# EAGLE schematic Motherboard Schematics - 1 - 29_Dec_2020 (EAGLE 9.6.2)
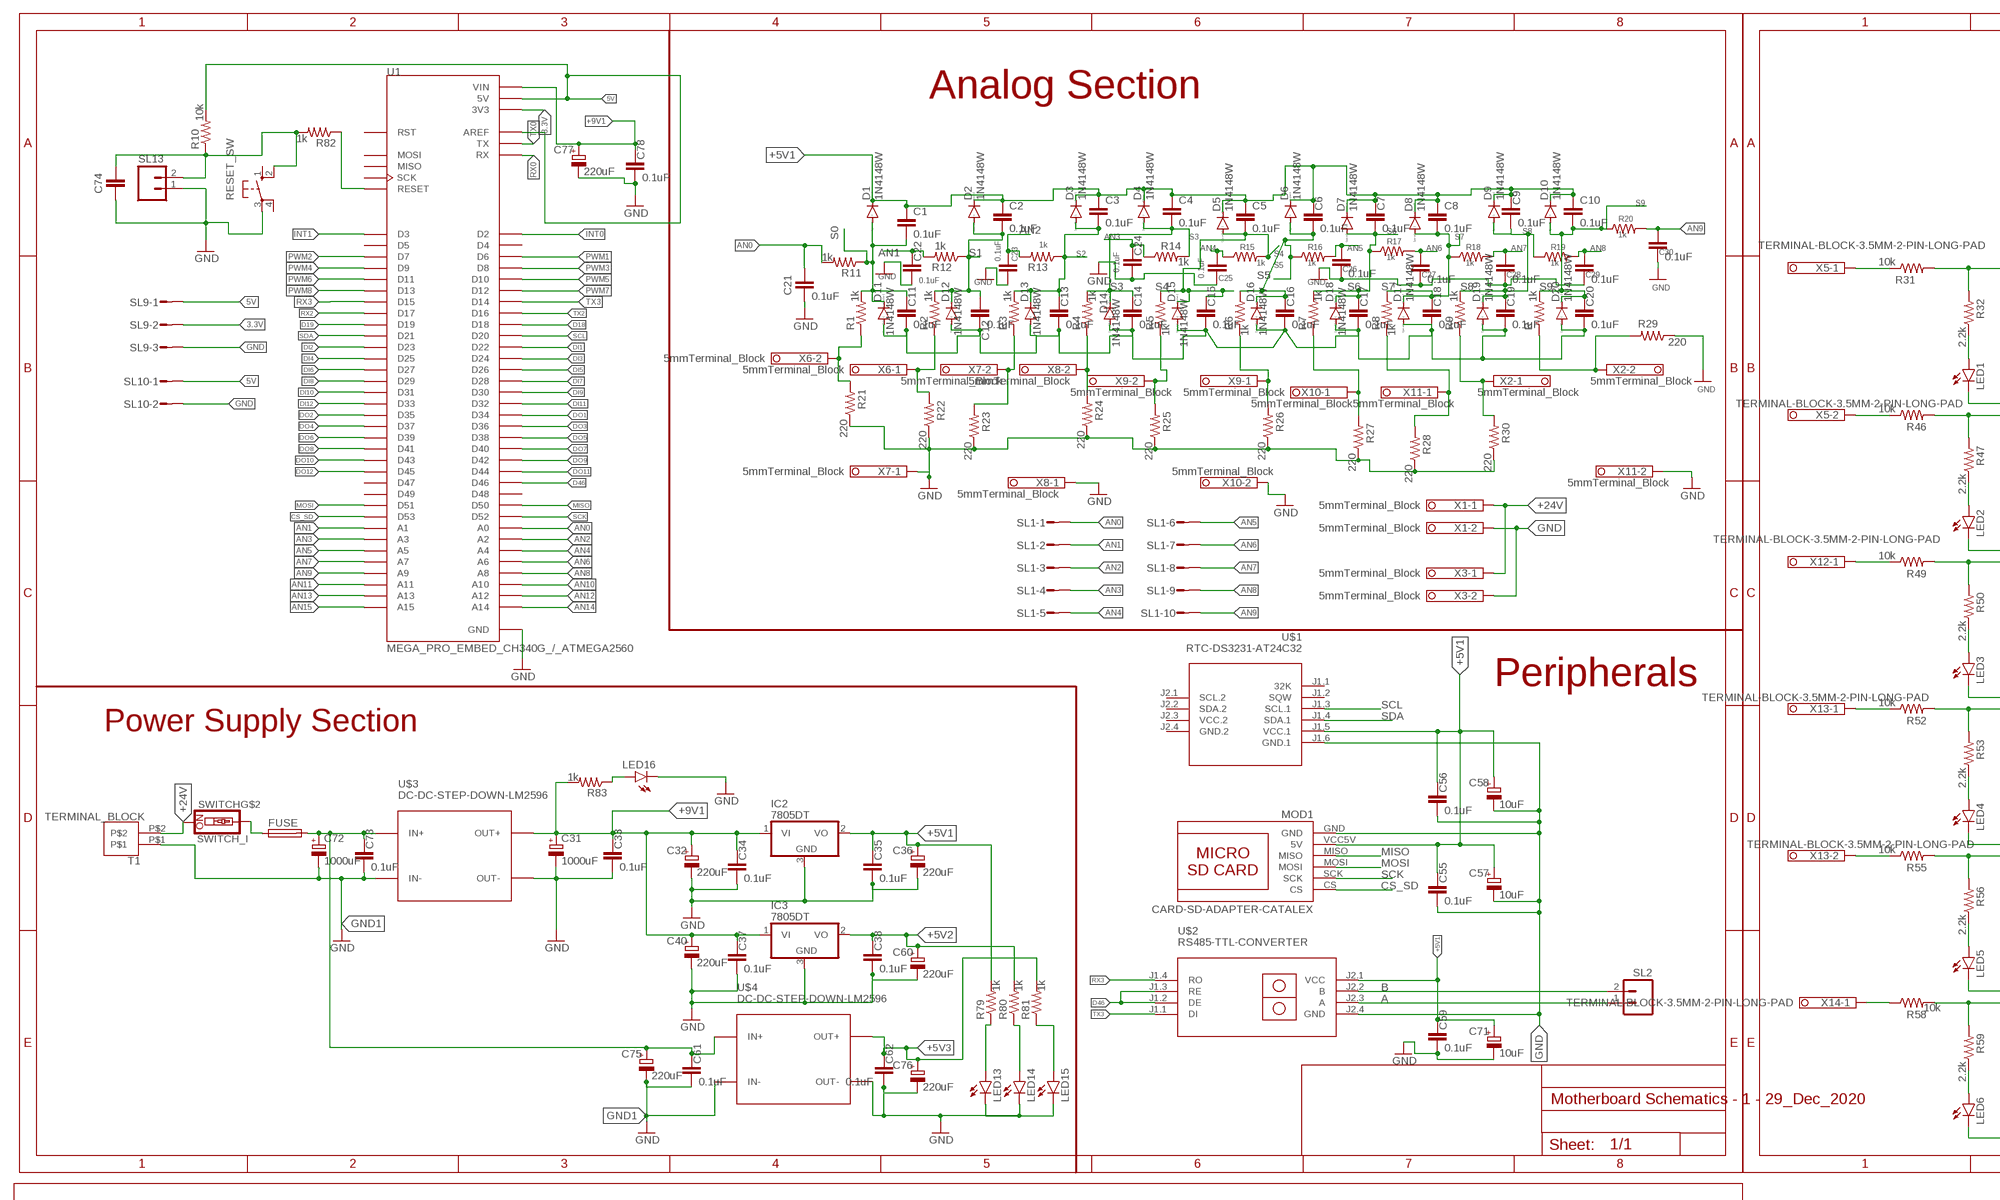
[diagram p0: schematic, sheet 1, part 1 of 3]
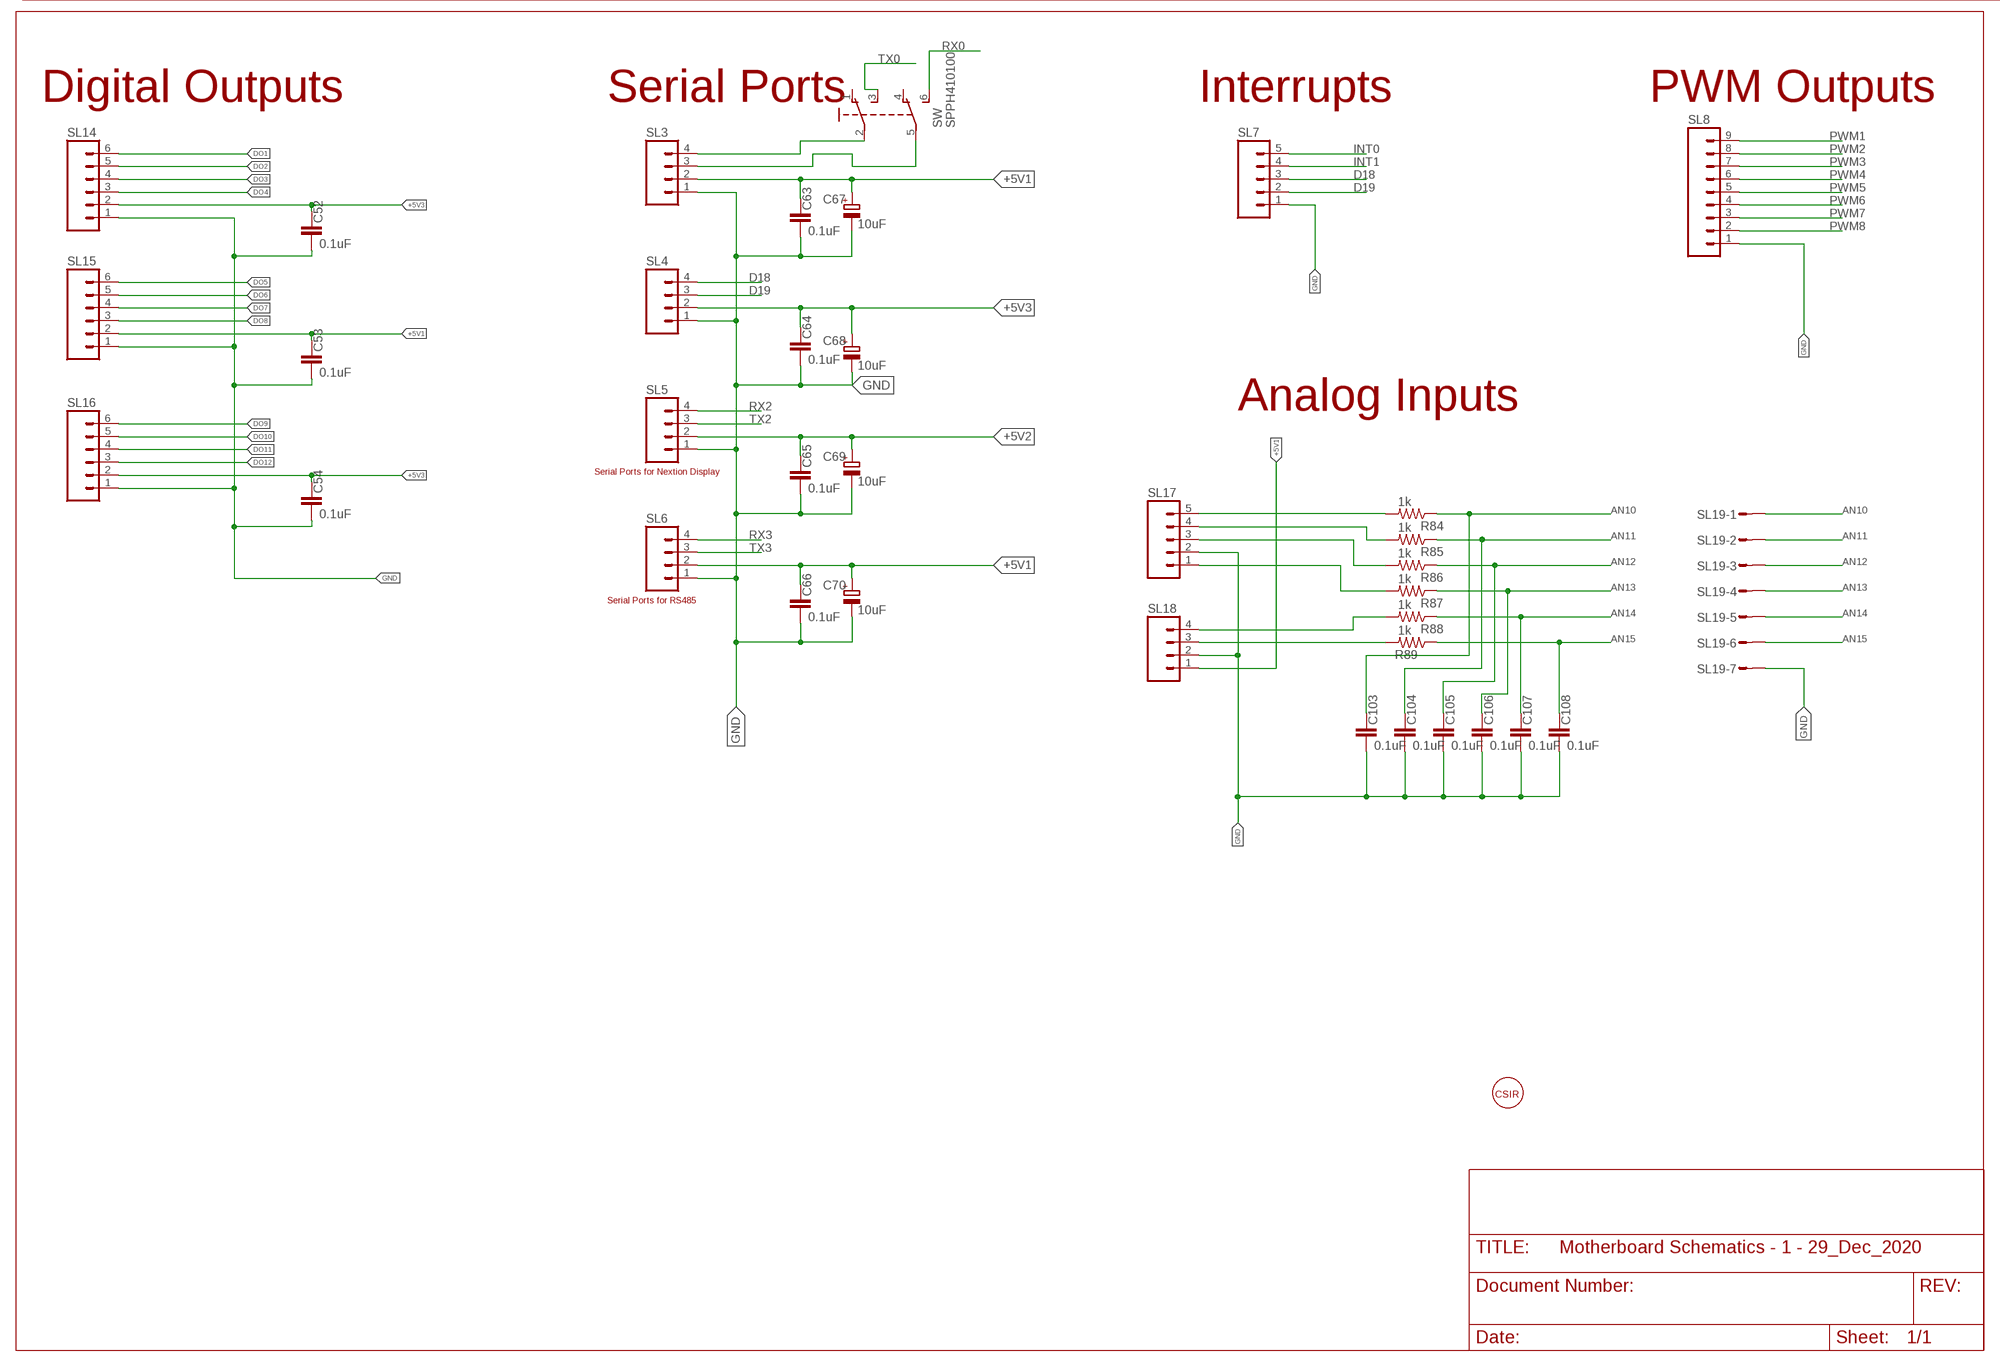
[diagram p1: schematic, sheet 1, part 2 of 3]
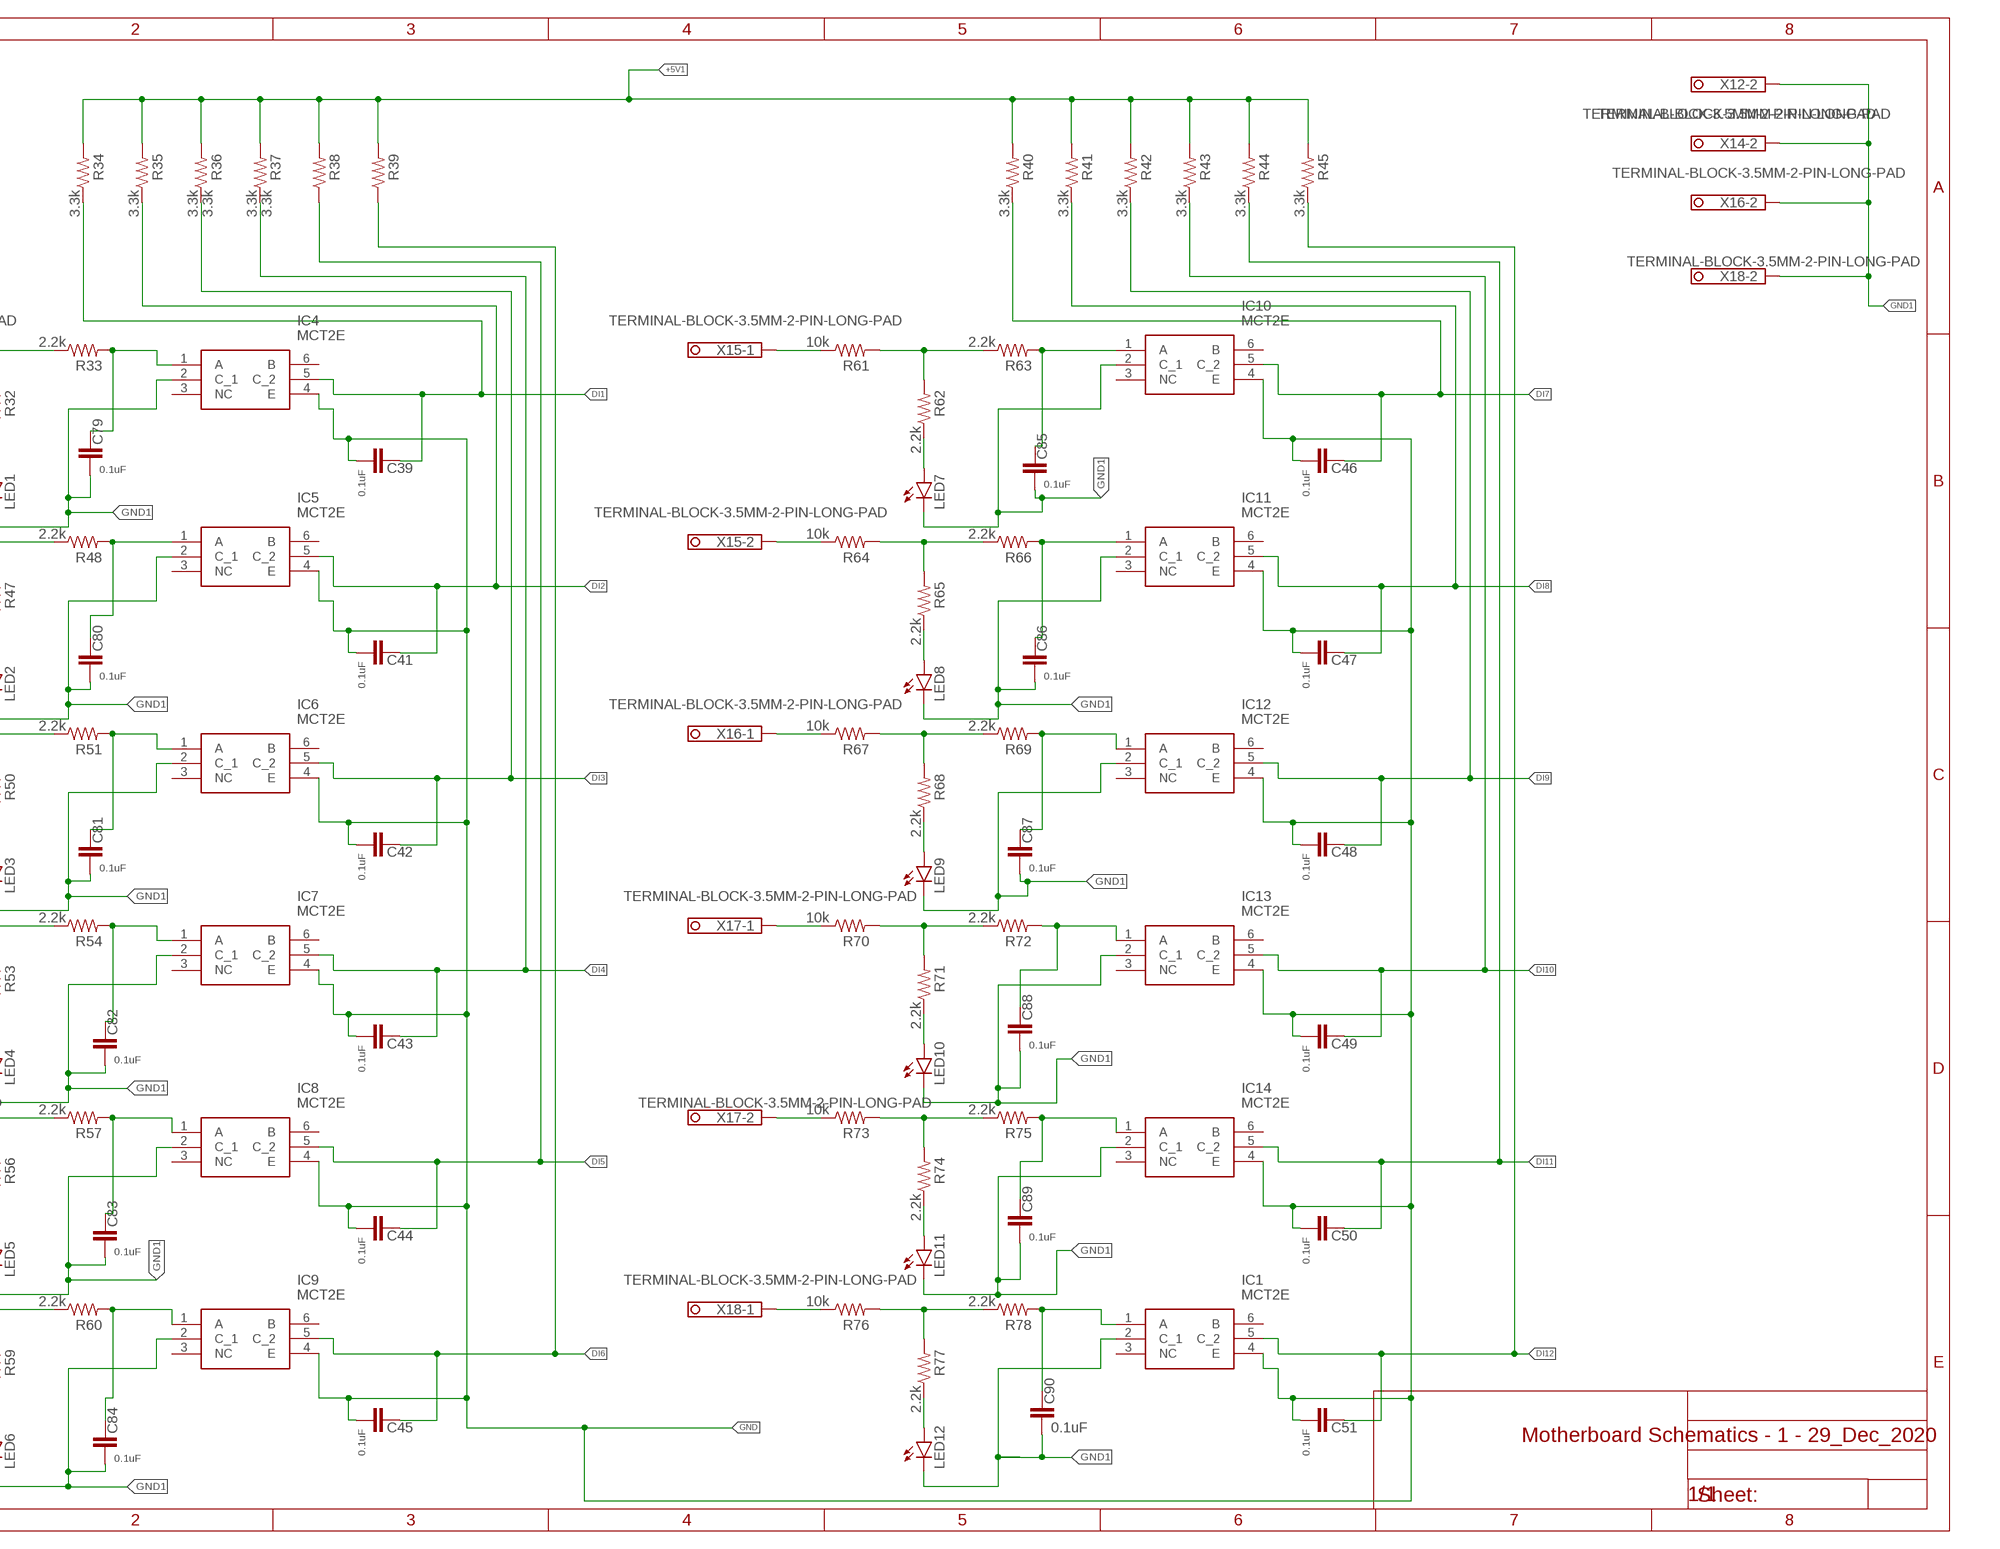
[diagram p2: schematic, sheet 1, part 3 of 3]

## Parts
C1  0.1uF  C-EUC1206  [C1206]
C2  0.1uF  C-EUC1206  [C1206]
C3  0.1uF  C-EUC1206  [C1206]
C4  0.1uF  C-EUC1206  [C1206]
C5  0.1uF  C-EUC1206  [C1206]
C6  0.1uF  C-EUC1206  [C1206]
C7  0.1uF  C-EUC1206  [C1206]
C8  0.1uF  C-EUC1206  [C1206]
C9  0.1uF  C-EUC1206  [C1206]
C10  0.1uF  C-EUC1206  [C1206]
C11  0.1uF  C-EUC1206  [C1206]
C12  0.1uF  C-EUC1206  [C1206]
C13  0.1uF  C-EUC1206  [C1206]
C14  0.1uF  C-EUC1206  [C1206]
C15  0.1uF  C-EUC1206  [C1206]
C16  0.1uF  C-EUC1206  [C1206]
C17  0.1uF  C-EUC1206  [C1206]
C18  0.1uF  C-EUC1206  [C1206]
C19  0.1uF  C-EUC1206  [C1206]
C20  0.1uF  C-EUC1206  [C1206]
C21  0.1uF  C-EUC1206  [C1206]
C22  0.1uF  C-EUC1206  [C1206]
C23  0.1uF  C-EUC1206  [C1206]
C24  0.1uF  C-EUC1206  [C1206]
C25  0.1uF  C-EUC1206  [C1206]
C26  0.1uF  C-EUC1206  [C1206]
C27  0.1uF  C-EUC1206  [C1206]
C28  0.1uF  C-EUC1206  [C1206]
C29  0.1uF  C-EUC1206  [C1206]
C30  0.1uF  C-EUC1206  [C1206]
C31  1000uF  CPOL-EUE7.5-16  [E7,5-16]
C32  220uF  CPOL-EUE5-10.5  [E5-10,5]
C33  0.1uF  C-EUC1206  [C1206]
C34  0.1uF  C-EUC1206  [C1206]
C35  0.1uF  C-EUC1206  [C1206]
C36  220uF  CPOL-EUE5-10.5  [E5-10,5]
C37  0.1uF  C-EUC1206  [C1206]
C38  0.1uF  C-EUC1206  [C1206]
C39  0.1uF  C-EUC1206  [C1206]
C40  220uF  CPOL-EUE5-10.5  [E5-10,5]
C41  0.1uF  C-EUC1206  [C1206]
C42  0.1uF  C-EUC1206  [C1206]
C43  0.1uF  C-EUC1206  [C1206]
C44  0.1uF  C-EUC1206  [C1206]
C45  0.1uF  C-EUC1206  [C1206]
C46  0.1uF  C-EUC1206  [C1206]
C47  0.1uF  C-EUC1206  [C1206]
C48  0.1uF  C-EUC1206  [C1206]
C49  0.1uF  C-EUC1206  [C1206]
C50  0.1uF  C-EUC1206  [C1206]
C51  0.1uF  C-EUC1206  [C1206]
C52  0.1uF  C-EUC1206  [C1206]
C53  0.1uF  C-EUC1206  [C1206]
C54  0.1uF  C-EUC1206  [C1206]
C55  0.1uF  C-EUC1206  [C1206]
C56  0.1uF  C-EUC1206  [C1206]
C57  10uF  CPOL-EUE2.5-7  [E2,5-7]
C58  10uF  CPOL-EUE2.5-7  [E2,5-7]
C59  0.1uF  C-EUC1206  [C1206]
C60  220uF  CPOL-EUE5-10.5  [E5-10,5]
C61  0.1uF  C-EUC1206  [C1206]
C62  0.1uF  C-EUC1206  [C1206]
C63  0.1uF  C-EUC1206  [C1206]
C64  0.1uF  C-EUC1206  [C1206]
C65  0.1uF  C-EUC1206  [C1206]
C66  0.1uF  C-EUC1206  [C1206]
C67  10uF  CPOL-EUE2.5-7  [E2,5-7]
C68  10uF  CPOL-EUE2.5-7  [E2,5-7]
C69  10uF  CPOL-EUE2.5-7  [E2,5-7]
C70  10uF  CPOL-EUE2.5-7  [E2,5-7]
C71  10uF  CPOL-EUE2.5-7  [E2,5-7]
C72  1000uF  CPOL-EUE7.5-16  [E7,5-16]
C73  0.1uF  C-EUC1206  [C1206]
C74  0.1uF  C-EUC1206  [C1206]
C75  220uF  CPOL-EUE5-10.5  [E5-10,5]
C76  220uF  CPOL-EUE5-10.5  [E5-10,5]
C77  220uF  CPOL-EUE5-10.5  [E5-10,5]
C78  0.1uF  C-EUC1206  [C1206]
C79  0.1uF  C-EUC1206  [C1206]
C80  0.1uF  C-EUC1206  [C1206]
C81  0.1uF  C-EUC1206  [C1206]
C82  0.1uF  C-EUC1206  [C1206]
C83  0.1uF  C-EUC1206  [C1206]
C84  0.1uF  C-EUC1206  [C1206]
C85  0.1uF  C-EUC1206  [C1206]
C86  0.1uF  C-EUC1206  [C1206]
C87  0.1uF  C-EUC1206  [C1206]
C88  0.1uF  C-EUC1206  [C1206]
C89  0.1uF  C-EUC1206  [C1206]
C90  0.1uF  C-EUC1206  [C1206]
C103  0.1uF  C-EUC1206  [C1206]
C104  0.1uF  C-EUC1206  [C1206]
C105  0.1uF  C-EUC1206  [C1206]
C106  0.1uF  C-EUC1206  [C1206]
C107  0.1uF  C-EUC1206  [C1206]
C108  0.1uF  C-EUC1206  [C1206]
D1  1N4148W  DIODE-DO214AC  [DO214AC]
D2  1N4148W  DIODE-DO214AC  [DO214AC]
D3  1N4148W  DIODE-DO214AC  [DO214AC]
D4  1N4148W  DIODE-DO214AC  [DO214AC]
D5  1N4148W  DIODE-DO214AC  [DO214AC]
D6  1N4148W  DIODE-DO214AC  [DO214AC]
D7  1N4148W  DIODE-DO214AC  [DO214AC]
D8  1N4148W  DIODE-DO214AC  [DO214AC]
D9  1N4148W  DIODE-DO214AC  [DO214AC]
D10  1N4148W  DIODE-DO214AC  [DO214AC]
D11  1N4148W  DIODE-DO214AC  [DO214AC]
D12  1N4148W  DIODE-DO214AC  [DO214AC]
D13  1N4148W  DIODE-DO214AC  [DO214AC]
D14.  1N4148W  DIODE-DO214AC  [DO214AC]
D15  1N4148W  DIODE-DO214AC  [DO214AC]
D16  1N4148W  DIODE-DO214AC  [DO214AC]
D17  1N4148W  DIODE-DO214AC  [DO214AC]
D18  1N4148W  DIODE-DO214AC  [DO214AC]
D19  1N4148W  DIODE-DO214AC  [DO214AC]
D20  1N4148W  DIODE-DO214AC  [DO214AC]
FUSE  SH22,5A  [SH22,5A]
IC1  MCT2E  [DIP762W60P254L712H480Q6N]
IC2  7805DT  [TO252]
IC3  7805DT  [TO252]
IC4  MCT2E  [DIP762W60P254L712H480Q6N]
IC5  MCT2E  [DIP762W60P254L712H480Q6N]
IC6  MCT2E  [DIP762W60P254L712H480Q6N]
IC7  MCT2E  [DIP762W60P254L712H480Q6N]
IC8  MCT2E  [DIP762W60P254L712H480Q6N]
IC9  MCT2E  [DIP762W60P254L712H480Q6N]
IC10  MCT2E  [DIP762W60P254L712H480Q6N]
IC11  MCT2E  [DIP762W60P254L712H480Q6N]
IC12  MCT2E  [DIP762W60P254L712H480Q6N]
IC13  MCT2E  [DIP762W60P254L712H480Q6N]
IC14  MCT2E  [DIP762W60P254L712H480Q6N]
LED1  LEDCHIPLED_1206  [CHIPLED_1206]
LED2  LEDCHIPLED_1206  [CHIPLED_1206]
LED3  LEDCHIPLED_1206  [CHIPLED_1206]
LED4  LEDCHIPLED_1206  [CHIPLED_1206]
LED5  LEDCHIPLED_1206  [CHIPLED_1206]
LED6  LEDCHIPLED_1206  [CHIPLED_1206]
LED7  LEDCHIPLED_1206  [CHIPLED_1206]
LED8  LEDCHIPLED_1206  [CHIPLED_1206]
LED9  LEDCHIPLED_1206  [CHIPLED_1206]
LED10  LEDCHIPLED_1206  [CHIPLED_1206]
LED11  LEDCHIPLED_1206  [CHIPLED_1206]
LED12  LEDCHIPLED_1206  [CHIPLED_1206]
LED13  LEDCHIPLED_1206  [CHIPLED_1206]
LED14  LEDCHIPLED_1206  [CHIPLED_1206]
LED15  LEDCHIPLED_1206  [CHIPLED_1206]
LED16  LEDCHIPLED_1206  [CHIPLED_1206]
MOD1  CARD-SD-ADAPTER-CATALEX  [CARD-SD-ADAPTER-CATALEX]
R  1k  R-US_R1206  [R1206]
R1  1k  R-US_R1206  [R1206]
R2  1k  R-US_R1206  [R1206]
R3  1k  R-US_R1206  [R1206]
R4  1k  R-US_R1206  [R1206]
R5  1k  R-US_R1206  [R1206]
R6  1k  R-US_R1206  [R1206]
R7  1k  R-US_R1206  [R1206]
R8  1k  R-US_R1206  [R1206]
R9  1k  R-US_R1206  [R1206]
R10  10k  R-US_R1206  [R1206]
R11  1k  R-US_R1206  [R1206]
R12  1k  R-US_R1206  [R1206]
R13  1k  R-US_R1206  [R1206]
R14  1k  R-US_R1206  [R1206]
R15  1k  R-US_R1206  [R1206]
R16  1k  R-US_R1206  [R1206]
R17  1k  R-US_R1206  [R1206]
R18  1k  R-US_R1206  [R1206]
R19  1k  R-US_R1206  [R1206]
R20  1k  R-US_R1206  [R1206]
R21  220  R-US_R1206  [R1206]
R22  220  R-US_R1206  [R1206]
R23  220  R-US_R1206  [R1206]
R24  220  R-US_R1206  [R1206]
R25  220  R-US_R1206  [R1206]
R26  220  R-US_R1206  [R1206]
R27  220  R-US_R1206  [R1206]
R28  220  R-US_R1206  [R1206]
R29  220  R-US_R1206  [R1206]
R30  220  R-US_R1206  [R1206]
R31  10k  R-US_R1206  [R1206]
R32  2.2k  R-US_R1206  [R1206]
R33  2.2k  R-US_R1206  [R1206]
R34  3.3k  R-US_R1206  [R1206]
R35  3.3k  R-US_R1206  [R1206]
R36  3.3k  R-US_R1206  [R1206]
R37  3.3k  R-US_R1206  [R1206]
R38  3.3k  R-US_R1206  [R1206]
R39  3.3k  R-US_R1206  [R1206]
R40  3.3k  R-US_R1206  [R1206]
R41  3.3k  R-US_R1206  [R1206]
R42  3.3k  R-US_R1206  [R1206]
R43  3.3k  R-US_R1206  [R1206]
R44  3.3k  R-US_R1206  [R1206]
R45  3.3k  R-US_R1206  [R1206]
R46  10k  R-US_R1206  [R1206]
R47  2.2k  R-US_R1206  [R1206]
R48  2.2k  R-US_R1206  [R1206]
R49  10k  R-US_R1206  [R1206]
R50  2.2k  R-US_R1206  [R1206]
R51  2.2k  R-US_R1206  [R1206]
R52  10k  R-US_R1206  [R1206]
R53  2.2k  R-US_R1206  [R1206]
R54  2.2k  R-US_R1206  [R1206]
R55  10k  R-US_R1206  [R1206]
R56  2.2k  R-US_R1206  [R1206]
R57  2.2k  R-US_R1206  [R1206]
R58  10k  R-US_R1206  [R1206]
R59  2.2k  R-US_R1206  [R1206]
R60  2.2k  R-US_R1206  [R1206]
R61  10k  R-US_R1206  [R1206]
R62  2.2k  R-US_R1206  [R1206]
R63  2.2k  R-US_R1206  [R1206]
R64  10k  R-US_R1206  [R1206]
R65  2.2k  R-US_R1206  [R1206]
R66  2.2k  R-US_R1206  [R1206]
R67  10k  R-US_R1206  [R1206]
R68  2.2k  R-US_R1206  [R1206]
R69  2.2k  R-US_R1206  [R1206]
R70  10k  R-US_R1206  [R1206]
R71  2.2k  R-US_R1206  [R1206]
R72  2.2k  R-US_R1206  [R1206]
R73  10k  R-US_R1206  [R1206]
R74  2.2k  R-US_R1206  [R1206]
R75  2.2k  R-US_R1206  [R1206]
R76  10k  R-US_R1206  [R1206]
R77  2.2k  R-US_R1206  [R1206]
R78  2.2k  R-US_R1206  [R1206]
R79  1k  R-US_R1206  [R1206]
R80  1k  R-US_R1206  [R1206]
R81  1k  R-US_R1206  [R1206]
R82  1k  R-US_R1206  [R1206]
R83  1k  R-US_R1206  [R1206]
R84  1k  R-US_R1206  [R1206]
R85  1k  R-US_R1206  [R1206]
R86  1k  R-US_R1206  [R1206]
R87  1k  R-US_R1206  [R1206]
R88  1k  R-US_R1206  [R1206]
R89  1k  R-US_R1206  [R1206]
RESET_SW  10-XX  [B3F-10XX]
SL1  M10S  [10P]
SL2  M02  [02P]
SL3  M04  [04P]
SL4  M04  [04P]
SL5  M04  [04P]
SL6  M04  [04P]
SL7  M05  [05P]
SL8  M09  [09P]
SL9  M03S  [03P]
SL10  M02S  [02P]
SL13  M02  [02P]
SL14  M06  [06P]
SL15  M06  [06P]
SL16  M06  [06P]
SL17  M05  [05P]
SL18  M04  [04P]
SL19  M07S  [07P]
SW  SPPH410100  [SPPH410100]
SWITCH  SWITCH_I  [SWITCH_I]
T1  TERMINAL_BLOCK  [BOC_TERMINAL]
U1  MEGA_PRO_EMBED_CH340G_/_ATMEGA2560  [MODULE_MEGA_PRO_EMBED_CH340G_/_ATMEGA2560]
U$1  RTC-DS3231-AT24C32  [RTC-DS3231-AT24C32]
U$2  RS485-TTL-CONVERTER  [RS485-TTL-CONVERTER]
U$3  DC-DC-STEP-DOWN-LM2596  [DC-DC-STEP-DOWN-LM2596]
U$4  DC-DC-STEP-DOWN-LM2596  [DC-DC-STEP-DOWN-LM2596]
U$5  CSIR_LOGO  [CSIR_LOGO]
X1  5mmTerminal_Block  TERMINAL-BLOCK-3.5MM-2-PIN-LONG-PAD  [TERMINAL-BLOCK-2-PIN-3.5MM-LONG-PAD]
X2  5mmTerminal_Block  TERMINAL-BLOCK-3.5MM-2-PIN-LONG-PAD  [TERMINAL-BLOCK-2-PIN-3.5MM-LONG-PAD]
X3  5mmTerminal_Block  TERMINAL-BLOCK-3.5MM-2-PIN-LONG-PAD  [TERMINAL-BLOCK-2-PIN-3.5MM-LONG-PAD]
X5  TERMINAL-BLOCK-3.5MM-2-PIN-LONG-PAD  [TERMINAL-BLOCK-2-PIN-3.5MM-LONG-PAD]
X6  5mmTerminal_Block  TERMINAL-BLOCK-3.5MM-2-PIN-LONG-PAD  [TERMINAL-BLOCK-2-PIN-3.5MM-LONG-PAD]
X7  5mmTerminal_Block  TERMINAL-BLOCK-3.5MM-2-PIN-LONG-PAD  [TERMINAL-BLOCK-2-PIN-3.5MM-LONG-PAD]
X8  5mmTerminal_Block  TERMINAL-BLOCK-3.5MM-2-PIN-LONG-PAD  [TERMINAL-BLOCK-2-PIN-3.5MM-LONG-PAD]
X9  5mmTerminal_Block  TERMINAL-BLOCK-3.5MM-2-PIN-LONG-PAD  [TERMINAL-BLOCK-2-PIN-3.5MM-LONG-PAD]
X10  5mmTerminal_Block  TERMINAL-BLOCK-3.5MM-2-PIN-LONG-PAD  [TERMINAL-BLOCK-2-PIN-3.5MM-LONG-PAD]
X11  5mmTerminal_Block  TERMINAL-BLOCK-3.5MM-2-PIN-LONG-PAD  [TERMINAL-BLOCK-2-PIN-3.5MM-LONG-PAD]
X12  TERMINAL-BLOCK-3.5MM-2-PIN-LONG-PAD  [TERMINAL-BLOCK-2-PIN-3.5MM-LONG-PAD]
X13  TERMINAL-BLOCK-3.5MM-2-PIN-LONG-PAD  [TERMINAL-BLOCK-2-PIN-3.5MM-LONG-PAD]
X14  TERMINAL-BLOCK-3.5MM-2-PIN-LONG-PAD  [TERMINAL-BLOCK-2-PIN-3.5MM-LONG-PAD]
X15  TERMINAL-BLOCK-3.5MM-2-PIN-LONG-PAD  [TERMINAL-BLOCK-2-PIN-3.5MM-LONG-PAD]
X16  TERMINAL-BLOCK-3.5MM-2-PIN-LONG-PAD  [TERMINAL-BLOCK-2-PIN-3.5MM-LONG-PAD]
X17  TERMINAL-BLOCK-3.5MM-2-PIN-LONG-PAD  [TERMINAL-BLOCK-2-PIN-3.5MM-LONG-PAD]
X18  TERMINAL-BLOCK-3.5MM-2-PIN-LONG-PAD  [TERMINAL-BLOCK-2-PIN-3.5MM-LONG-PAD]

## Nets
3.3V: SL9.2 U1.3V3_1(3V3) U1.3V3_2(3V3)
5V: R10.2 SL9.1 SL10.1 U1.5V_1(5V) U1.5V_2(5V) U1.5V_3(5V) U1.AREF
+5V1: C1.1 C2.1 C3.1 C4.1 C5.1 C6.1 C7.1 C8.1 C9.1 C10.1 C35.1 C36.+ C53.1 C55.1 C56.1 C57.+ C58.+ C59.1 C63.1 C66.1 C67.+ C70.+ C71.+ D1.C D2.C D3.C D4.C D5.C D6.C D7.C D8.C D9.C D10.C IC2.2(VO) MOD1.VCC5V(5V) R34.2 R35.2 R36.2 R37.2 R38.2 R39.2 R40.2 R41.2 R42.2 R43.2 R44.2 R45.2 R79.2 SL3.2 SL6.2 SL15.2 SL18.1 U$1.J1.5(VCC.1) U$2.J2.1(VCC)
+5V2: C38.1 C60.+ C65.1 C69.+ IC3.2(VO) R80.2 SL5.2
+5V3: C52.1 C54.1 C62.1 C64.1 C68.+ C76.+ R81.2 SL4.2 SL14.2 SL16.2 U$4.OUT+
+9V1: C31.+ C32.+ C33.1 C34.1 C37.1 C40.+ C77.+ C78.1 IC2.1(VI) IC3.1(VI) R83.2 U1.VIN_1(VIN) U1.VIN_2(VIN) U$3.OUT+
+24V: SWITCH.P$3 T1.P$2 X1.1 X3.1
A: SL2.1 U$2.J2.3(A)
AN0: C21.1 R11.2 SL1.1 U1.A0
AN1: C22.1 R12.2 SL1.2 U1.A1
AN2: C23.1 R13.2 SL1.3 U1.A2
AN3: C24.1 R14.1 SL1.4 U1.A3
AN4: C25.1 R15.1 SL1.5 U1.A4
AN5: C26.1 R16.2 SL1.6 U1.A5
AN6: C27.1 R17.2 SL1.7 U1.A6
AN7: C28.1 R18.2 SL1.8 U1.A7
AN8: C29.1 R19.2 SL1.9 U1.A8
AN9: C30.1 R20.2 SL1.10 U1.A9
AN10: C103.1 R84.1 SL19.1 U1.A10
AN11: C104.1 R85.1 SL19.2 U1.A11
AN12: C105.1 R86.1 SL19.3 U1.A12
AN13: C106.1 R87.1 SL19.4 U1.A13
AN14: C107.1 R88.1 SL19.5 U1.A14
AN15: C108.1 R89.1 SL19.6 U1.A15
B: SL2.2 U$2.J2.2(B)
CS_SD: MOD1.CS U1.D53
D18: SL4.4 SL7.3 U1.D18
D19: SL4.3 SL7.2 U1.D19
D46: U1.D46 U$2.J1.2(DE) U$2.J1.3(RE)
DI1: C39.1 IC4.5(C_2) R34.1 U1.D22
DI2: C41.1 IC5.5(C_2) R35.1 U1.D23
DI3: C42.1 IC6.5(C_2) R36.1 U1.D24
DI4: C43.1 IC7.5(C_2) R37.1 U1.D25
DI5: C44.1 IC8.5(C_2) R38.1 U1.D26
DI6: C45.1 IC9.5(C_2) R39.1 U1.D27
DI7: C46.1 IC10.5(C_2) R40.1 U1.D28
DI8: C47.1 IC11.5(C_2) R41.1 U1.D29
DI9: C48.1 IC12.5(C_2) R42.1 U1.D30
DI10: C49.1 IC13.5(C_2) R43.1 U1.D31
DI11: C50.1 IC14.5(C_2) R44.1 U1.D32
DI12: C51.1 IC1.5(C_2) R45.1 U1.D33
DO1: SL14.6 U1.D34
DO2: SL14.5 U1.D35
DO3: SL14.4 U1.D36
DO4: SL14.3 U1.D37
DO5: SL15.6 U1.D38
DO6: SL15.5 U1.D39
DO7: SL15.4 U1.D40
DO8: SL15.3 U1.D41
DO9: SL16.6 U1.D42
DO10: SL16.5 U1.D43
DO11: SL16.4 U1.D44
DO12: SL16.3 U1.D45
GND: C21.2 C22.2 C23.2 C24.2 C25.2 C26.2 C27.2 C28.2 C29.2 C30.2 C31.- C32.- C33.2 C34.2 C35.2 C36.- C37.2 C38.2 C39.2 C40.- C41.2 C42.2 C43.2 C44.2 C45.2 C46.2 C47.2 C48.2 C49.2 C50.2 C51.2 C52.2 C53.2 C54.2 C55.2 C56.2 C57.- C58.- C59.2 C60.- C62.2 C63.2 C64.2 C65.2 C66.2 C67.- C68.- C69.- C70.- C71.- C74.2 C76.- C77.- C78.2 C103.2 C104.2 C105.2 C106.2 C107.2 C108.2 IC1.4(E) IC2.3(GND) IC3.3(GND) IC4.4(E) IC5.4(E) IC6.4(E) IC7.4(E) IC8.4(E) IC9.4(E) IC10.4(E) IC11.4(E) IC12.4(E) IC13.4(E) IC14.4(E) LED13.C LED14.C LED15.C LED16.C MOD1.GND R21.1 R22.1 R23.1 R24.1 R25.1 R26.1 R27.1 R28.1 R29.1 R30.1 RESET_SW.3(P) SL3.1 SL4.1 SL5.1 SL6.1 SL7.1 SL8.1 SL9.3 SL10.2 SL13.1 SL14.1 SL15.1 SL16.1 SL17.2 SL18.2 SL19.7 U1.GND_1(GND) U1.GND_2(GND) U1.GND_3(GND) U$1.J1.6(GND.1) U$2.J2.4(GND) U$3.OUT- U$4.OUT- X1.2 X3.2 X7.1 X8.1 X10.2 X11.2
GND1: C61.2 C72.- C73.2 C75.- C79.2 C80.2 C81.2 C82.2 C83.2 C84.2 C85.2 C86.2 C87.2 C88.2 C89.2 C90.2 IC1.2(C_1) IC4.2(C_1) IC5.2(C_1) IC6.2(C_1) IC7.2(C_1) IC8.2(C_1) IC9.2(C_1) IC10.2(C_1) IC11.2(C_1) IC12.2(C_1) IC13.2(C_1) IC14.2(C_1) LED1.C LED2.C LED3.C LED4.C LED5.C LED6.C LED7.C LED8.C LED9.C LED10.C LED11.C LED12.C T1.P$1 U$3.IN- U$4.IN- X12.2 X14.2 X16.2 X18.2 ; supply symbol labelled GND
INT0: SL7.5 U1.D2
INT1: SL7.4 U1.D3
MISO: MOD1.MISO U1.D50
MOSI: MOD1.MOSI U1.D51
N$1: C11.2 C12.2 C13.2 C14.2 C15.2 C16.2 C17.2 C18.2 C19.2 C20.2 D11.A D12.A D13.A D14..A D15.A D16.A D17.A D18.A D19.A D20.A
N$3: R2.1 R22.2 X6.1
N$4: R3.1 R23.2 X7.2
N$5: R4.1 R24.2 X8.2
N$6: R52.1 X13.1
N$7: R58.1 X14.1
N$8: R5.1 R25.2 X9.2
N$9: R6.1 R26.2 X9.1
N$10: R7.1 R27.2 X10.1
N$11: R8.1 R28.2 X11.1
N$12: R9.1 R30.2 X2.1
N$13: R1.1 R21.2 X6.2
N$14: FUSE.1 SWITCH.P$1
N$15: R82.1 U1.RESET
N$16: R29.2 R.1 X2.2
N$17: R31.1 X5.1
N$18: R31.2 R32.2 R33.1
N$19: C79.1 IC4.1(A) R33.2
N$20: LED1.A R32.1
N$21: R55.1 X13.2
N$22: R46.1 X5.2
N$23: C88.1 IC13.1(A) R72.2
N$24: R46.2 R47.2 R48.1
N$25: C80.1 IC5.1(A) R48.2
N$26: LED2.A R47.1
N$27: R73.1 X17.2
N$28: R70.1 X17.1
N$29: R49.1 X12.1
N$30: R49.2 R50.2 R51.1
N$31: C81.1 IC6.1(A) R51.2
N$32: LED3.A R50.1
N$33: R61.1 X15.1
N$34: R61.2 R62.2 R63.1
N$35: R64.1 X15.2
N$36: R52.2 R53.2 R54.1
N$37: C82.1 IC7.1(A) R54.2
N$38: LED4.A R53.1
N$40: C85.1 IC10.1(A) R63.2
N$41: R84.2 SL17.5
N$42: SL3.4 SW.2(P)
N$43: C61.1 C72.+ C73.1 C75.+ FUSE.2 U$3.IN+ U$4.IN+
N$44: C74.1 R10.1 R82.2 RESET_SW.2(S1) SL13.2
N$45: R55.2 R56.2 R57.1
N$46: C83.1 IC8.1(A) R57.2
N$47: LED5.A R56.1
N$49: LED7.A R62.1
N$51: R58.2 R59.2 R60.1
N$52: C84.1 IC9.1(A) R60.2
N$53: LED6.A R59.1
N$56: R85.2 SL17.4
N$59: R64.2 R65.2 R66.1
N$60: C86.1 IC11.1(A) R66.2
N$61: LED8.A R65.1
N$63: R67.1 X16.1
N$64: R67.2 R68.2 R69.1
N$65: C87.1 IC12.1(A) R69.2
N$66: LED9.A R68.1
N$68: R70.2 R71.2 R72.1
N$69: LED13.A R79.1
N$70: LED10.A R71.1
N$71: LED14.A R80.1
N$73: R73.2 R74.2 R75.1
N$74: C89.1 IC14.1(A) R75.2
N$75: LED11.A R74.1
N$77: R76.2 R77.2 R78.1
N$78: C90.1 IC1.1(A) R78.2
N$79: LED12.A R77.1
N$83: R76.1 X18.1
N$84: LED15.A R81.1
N$85: SL3.3 SW.5(P1)
N$86: R86.2 SL17.3
N$88: LED16.A R83.1
N$90: R87.2 SL17.1
N$92: R88.2 SL18.4
N$93: R89.2 SL18.3
PWM1: SL8.9 U1.D6
PWM2: SL8.8 U1.D7
PWM3: SL8.7 U1.D8
PWM4: SL8.6 U1.D9
PWM5: SL8.5 U1.D10
PWM6: SL8.4 U1.D11
PWM7: SL8.3 U1.D12
PWM8: SL8.2 U1.D13
RX0: SW.6(S1) U1.RX
RX2: SL5.4 U1.D17
RX3: SL6.4 U1.D15 U$2.J1.4(RO)
S0: C1.2 C11.1 D1.A D11.C R1.2 R11.1
S1: C2.2 C12.1 D2.A D12.C R2.2 R12.1
S2: C3.2 C13.1 D3.A D13.C R3.2 R13.1
S3: C4.2 C14.1 D4.A D14..C R4.2 R14.2
S4: C5.2 C15.1 D5.A D15.C R5.2 R15.2
S5: C6.2 C16.1 D6.A D16.C R6.2 R16.1
S6: C7.2 C17.1 D7.A D18.C R7.2 R17.1
S7: C8.2 C18.1 D8.A D17.C R8.2 R18.1
S8: C9.2 C19.1 D9.A D19.C R9.2 R19.1
S9: C10.2 C20.1 D10.A D20.C R20.1 R.2
SCK: MOD1.SCK U1.D52
SCL: U1.D20 U$1.J1.3(SCL.1)
SDA: U1.D21 U$1.J1.4(SDA.1)
TX0: SW.3(S) U1.TX
TX2: SL5.3 U1.D16
TX3: SL6.3 U1.D14 U$2.J1.1(DI)
Unconnected: IC1.3(NC) IC1.6(B) IC4.3(NC) IC4.6(B) IC5.3(NC) IC5.6(B) IC6.3(NC) IC6.6(B) IC7.3(NC) IC7.6(B) IC8.3(NC) IC8.6(B) IC9.3(NC) IC9.6(B) IC10.3(NC) IC10.6(B) IC11.3(NC) IC11.6(B) IC12.3(NC) IC12.6(B) IC13.3(NC) IC13.6(B) IC14.3(NC) IC14.6(B) RESET_SW.1(S) RESET_SW.4(P1) SW.1(O) SW.4(O1) U1.D4 U1.D5 U1.D47 U1.D48 U1.D49 U1.MISO U1.MOSI U1.RST U1.SCK U$1.J1.1(32K) U$1.J1.2(SQW) U$1.J2.1(SCL.2) U$1.J2.2(SDA.2)

## Notes on the sheet
- Analog Section
- Peripherals
- Power Supply Section
- Digital Outputs | Serial Ports | Interrupts | PWM Outputs
- Analog Inputs
- Serial Ports for Nextion Display
- Serial Ports for RS485

## Power pins joined to a net without a drawn wire
GND.2: U$1.J2.4(GND.2)
VCC.2: U$1.J2.3(VCC.2)

## Library data of the parts
C1-C30 C33-C35 C37-C39 C41-C56 C59 C61-C66 C73 C74 C78-C90 C103-C108 = rcl:C-EU: CAPACITOR, European symbol; SPICEPREFIX: C
C31 C32 C36 C40 C57 C58 C60 C67-C72 C75-C77 = rcl:CPOL-EU: POLARIZED CAPACITOR, European symbol; SPICEPREFIX: C
D1-D13 D14. D15-D20 = diode:DIODE-: DIODE
FUSE = fuse:SH22,5A: FUSE HOLDER grid 22,5mm, isolated cap OGN0031 8201, Schurter (Buerklin); MPN: 0031.7701.11; OC_FARNELL: unknown; OC_NEWARK: 04F1224
IC1 IC4-IC14 = MCT2E:MCT2E: Transistor Output Optocouplers Optocouplers Source: Datasheet <https://www.mouser.com/datasheet/2/143/201407061947416393-365513.pdf>; ARROW_PART_NUMBER: MCT2E; ARROW_PRICE-STOCK: https://www.arrow.com/en/products/mct2e/everlight-electronics; DESCRIPTION: Transistor Output Optocouplers Optocouplers; HEIGHT: 4.8mm; MANUFACTURER_NAME: Everlight; MANUFACTURER_PART_NUMBER: MCT2E; MOUSER_PART_NUMBER: 638-MCT2E; MOUSER_PRICE-STOCK: https://www.mouser.co.uk/ProductDetail/Everlight/MCT2E?qs=8PzhAHr7IdNay24oEWwF1g%3D%3D
IC2 IC3 = linear:78*: Positive VOLTAGE REGULATOR Source: http://cache.national.com/ds/LM/LM78L05.pdf http://www.fairchildsemi.com/ds/LM/LM7805.pdf
LED1-LED16 = led:LED: LED OSRAM: - CHIPLED LG R971, LG N971, LY N971, LG Q971, LY Q971, LO R971, LY R971 LH N974, LH R974 LS Q976, LO Q976, LY Q976 LO Q996 - Hyper CHIPLED LW Q18S LB Q993, LB Q99A, LB R99A - SideLED LS A670, LO A670, LY A670, LG A670, LP A670 LB A673, LV A673, LT A673, LW A673 LH A674 LY A675 LS A676, LA A676, LO A676, LY A676, LW A676 LS A679, LY A679, LG A679 - Hyper Micro SIDELED® LS Y876, LA Y876, LO Y876, LY Y876 LT Y87S - SmartLED LW L88C, LW L88S LB L89C, LB L89S, LG L890 LS L89K, LO L89K, LY L89K LS L896, LA L896, LO L896, LY L896 - TOPLED LS T670, LO T670, LY T670, LG T670, LP T670 LSG T670, LSP T670, LSY T670, LOP T670, LYG T670 LG T671, LOG T671, LSG T671 LB T673, LV T673, LT T673, LW T673 LH T674 LS T676, LA T676, LO T676, LY T676, LB T676, LH T676, LSB T676, LW T676 LB T67C, LV T67C, LT T67C, LS T67K, LO T67K, LY T67K, LW E67C LS E67B, LA E67B, LO E67B, LY E67B, LB E67C, LV E67C, LT E67C LW T67C LS T679, LY T679, LG T679 LS T770, LO T770, LY T770, LG T770, LP T770 LB T773, LV T773, LT T773, LW T773 LH T774 LS E675, LA E675, LY E675, LS T675 LS T776, LA T776, LO T776, LY T776, LB T776 LHGB T686 LT T68C, LB T68C - Hyper Mini TOPLED® LB M676 - Mini TOPLED Santana® LG M470 LS M47K, LO M47K, LY M47K Source: http://www.osram.convergy.de LUXEON: - LUMILED® LXK2-PW12-R00, LXK2-PW12-S00, LXK2-PW14-U00, LXK2-PW14-V00 LXK2-PM12-R00, LXK2-PM12-S00, LXK2-PM14-U00 LXK2-PE12-Q00, LXK2-PE12-R00, LXK2-PE12-S00, LXK2-PE14-T00, LXK2-PE14-U00 LXK2-PB12-K00, LXK2-PB12-L00, LXK2-PB12-M00, LXK2-PB14-N00, LXK2-PB14-P00, LXK2-PB14-Q00 LXK2-PR12-L00, LXK2-PR12-M00, LXK2-PR14-Q00, LXK2-PR14-R00 LXK2-PD12-Q00, LXK2-PD12-R00, LXK2-PD12-S00 LXK2-PH12-R00, LXK2-PH12-S00 LXK2-PL12-P00, LXK2-PL12-Q00, LXK2-PL12-R00 Source: www.luxeon.com KINGBRIGHT: KA-3528ASYC Source: www.kingbright.com
MOD1 = SD-Card-Module_CATALEX:CARD-SD-ADAPTER-CATALEX: Micro SD Card Adapter Module with onboard 3.3V regulator
R R2-R9 R11-R81 R83-R89 = rcl:R-US_: RESISTOR, American symbol; SPICEPREFIX: R
R1 R10 R82 = modified cap:R-US_: RESISTOR, American symbol; SPICEPREFIX: R
RESET_SW = switch-omron:10-XX: OMRON SWITCH; MPN: B3F-1000; OC_FARNELL: 176432; OC_NEWARK: 36M3542
SL1 = con-amp-quick:M10S: AMP QUICK CONNECTOR; OC_FARNELL: unknown; OC_NEWARK: unknown
SL2 SL13 = con-amp-quick:M02: AMP QUICK CONNECTOR; OC_FARNELL: unknown; OC_NEWARK: unknown
SL3-SL6 SL18 = con-amp-quick:M04: AMP QUICK CONNECTOR; OC_FARNELL: unknown; OC_NEWARK: unknown
SL7 SL17 = con-amp-quick:M05: AMP QUICK CONNECTOR; OC_FARNELL: unknown; OC_NEWARK: unknown
SL8 = con-amp-quick:M09: AMP QUICK CONNECTOR; OC_FARNELL: unknown; OC_NEWARK: unknown
SL9 = con-amp-quick:M03S: AMP QUICK CONNECTOR; OC_FARNELL: unknown; OC_NEWARK: unknown
SL10 = con-amp-quick:M02S: AMP QUICK CONNECTOR; OC_FARNELL: unknown; OC_NEWARK: unknown
SL14-SL16 = con-amp-quick:M06: AMP QUICK CONNECTOR; OC_FARNELL: unknown; OC_NEWARK: unknown
SL19 = con-amp-quick:M07S: AMP QUICK CONNECTOR; OC_FARNELL: unknown; OC_NEWARK: unknown
SW = SPPH410100:SPPH410100: Check prices <https://pricing.snapeda.com/parts/SPPH410100/ALPS/view-part?ref=eda>; AVAILABILITY: Good; DESCRIPTION: Ring Type Encoder (ABC - three phase) • Number of Detent: 30 • Number of Pulse: 10 • Actuator Length: 15mm; MF: ALPS; MP: SPPH410100; PACKAGE: None; PRICE: None; PURCHASE-URL: https://pricing.snapeda.com/search/part/SPPH410100/?ref=eda
SWITCH = SWITCH-I:SWITCH_I
T1 = TERMINAL_BLOCK:TERMINAL_BLOCK
U1 = MEGA_PRO_EMBED_CH340G___ATMEGA2560:MEGA_PRO_EMBED_CH340G_/_ATMEGA2560: Mega 2560 PRO (Embed) CH340G/ATmega2560-16AU; AVAILABILITY: Unavailable; MF: Robotdyn; MP: Mega Pro Embed CH340G / ATmega2560; PACKAGE: Package; PRICE: None
U$1 = diy-modules:RTC-DS3231-AT24C32: RTC Module with Battery and EEPROM based on DS3231 and AT24C32 chips Tutorial can be found here: https://edwardmallon.wordpress.com/2014/05/21/using-a-cheap-3-ds3231-rtc-at24c32-eeprom-from-ebay/ Click here to find device on ebay.com <http://www.ebay.com/sch/DS3231+AT24C32+module>
U$2 = diy-modules (1):RS485-TTL-CONVERTER: RS485 to TTL converter based on MAX485 chip
U$3 U$4 = diy-modules:DC-DC-STEP-DOWN-LM2596: DC/DC Step-Down Regulator based on LM2596-ADJ chip LM2596 datasheet available here: http://www.ti.com/lit/ds/symlink/lm2596.pdf Click here to find device on ebay.com <http://www.ebay.com/sch/lm2596+power+regulator>
U$5 = CSIR_LOGO:CSIR_LOGO
X1-X3 X6-X11 = Terminal Block -5mm v1-0:TERMINAL-BLOCK-3.5MM-2-PIN: Terminal Block 3.5mm Pitch: 3,5 mm Number of pins: 2 Created by Rembrandt Electronics www.rembrandtelectronics.com
X5 X12-X18 = Rembrandt Electronics - Terminal Block 3-5mm v1-0:TERMINAL-BLOCK-3.5MM-2-PIN: Terminal Block 3.5mm Pitch: 3,5 mm Number of pins: 2 Created by Rembrandt Electronics www.rembrandtelectronics.com